# EAGLE design Z80_Sound_2 (EAGLE 5.11)
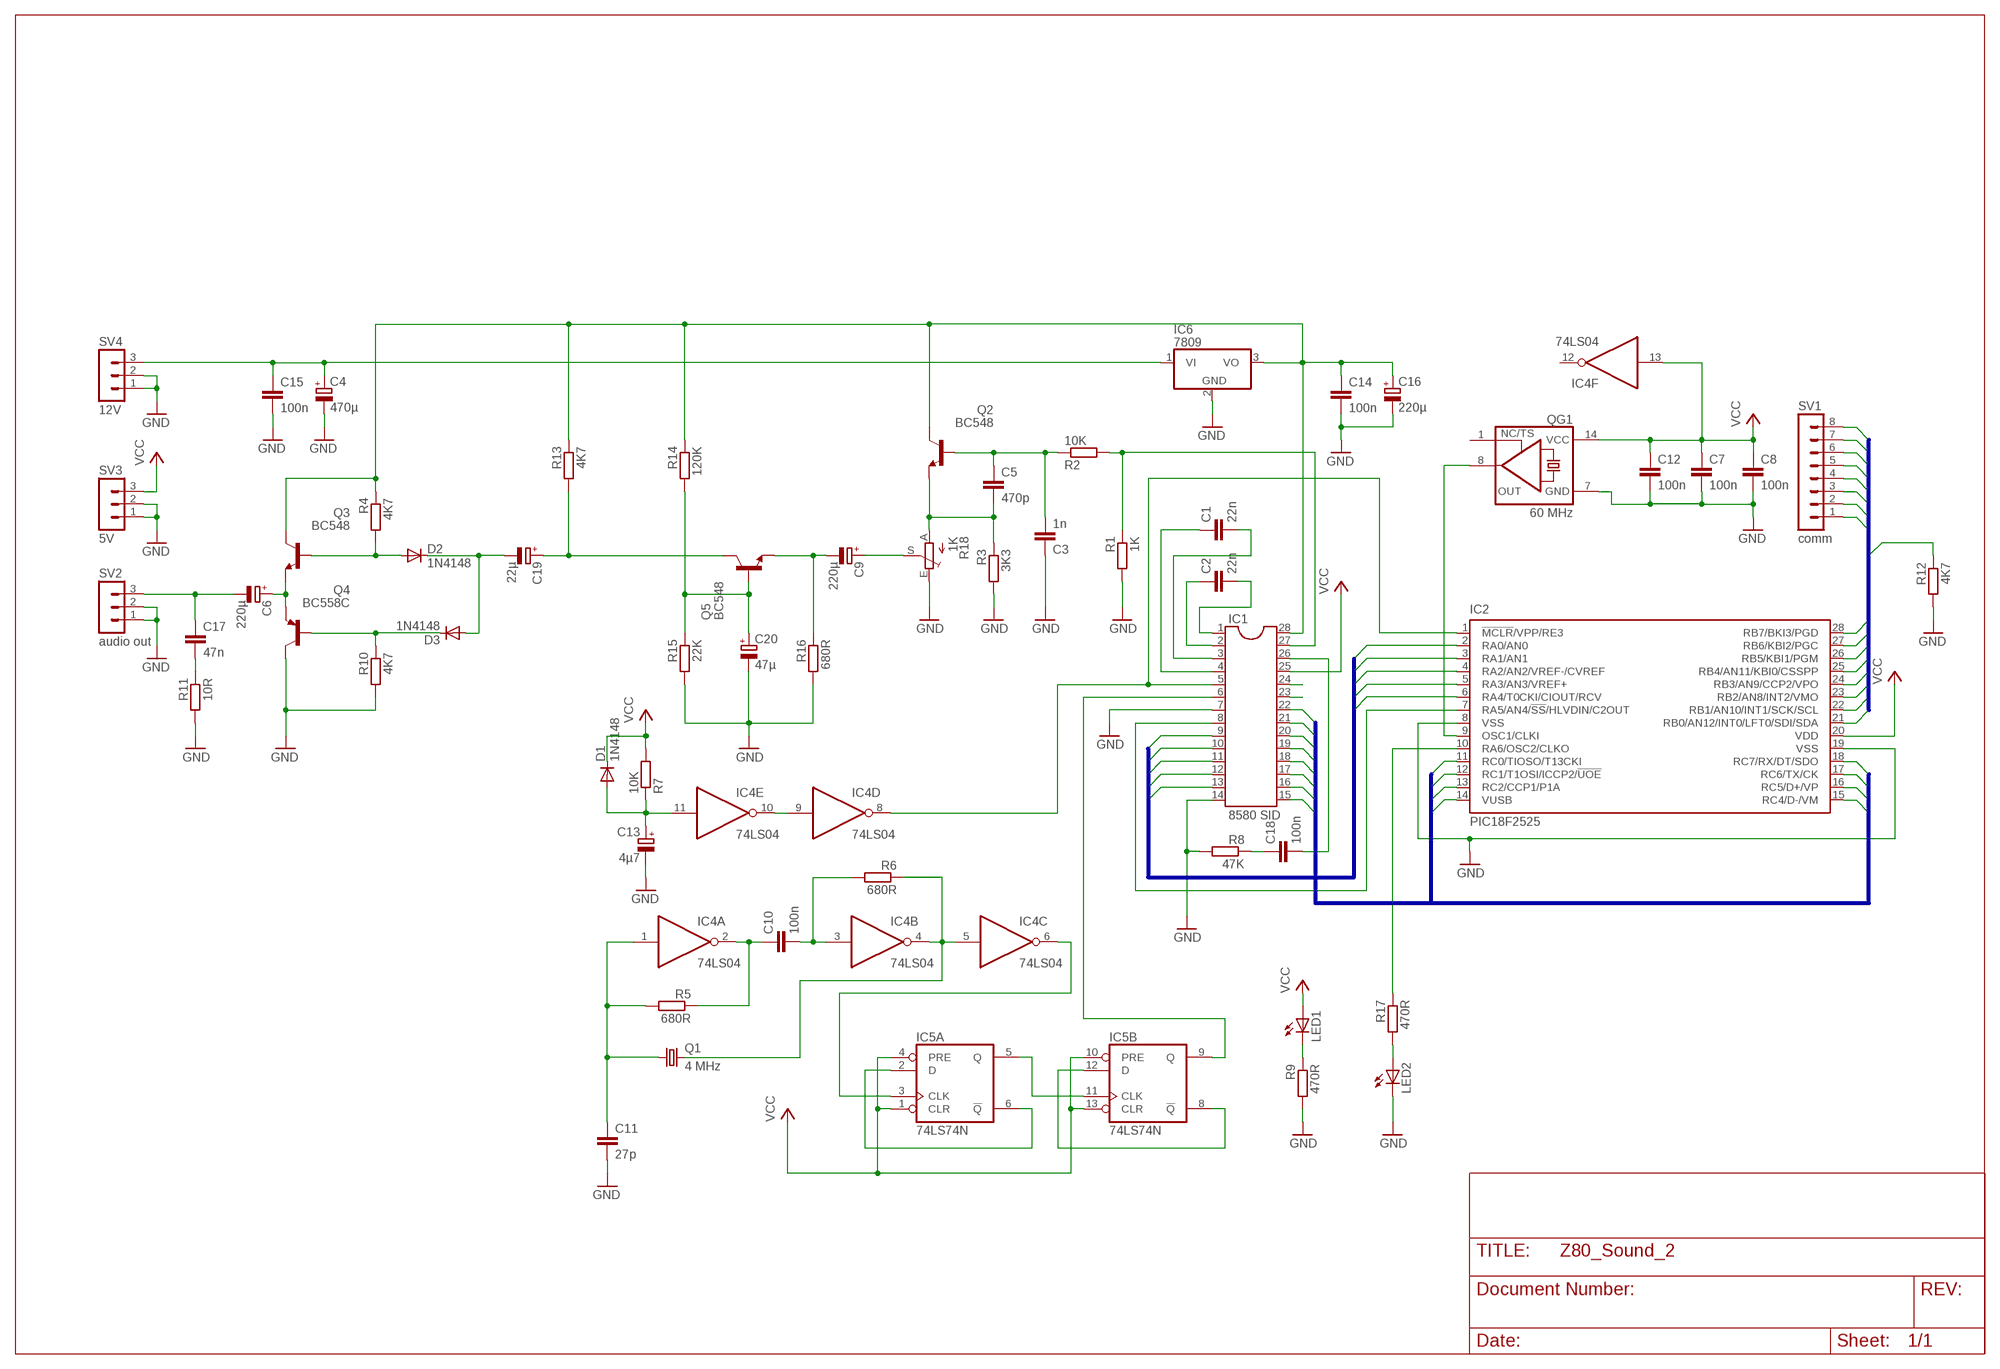
[diagram p0: schematic, sheet 1]

## Parts
C1  22n  C-EU050-035X075  [C050-035X075]
C2  22n  C-EU050-035X075  [C050-035X075]
C3  1n  C-EU050-035X075  [C050-035X075]
C4  470µ  CPOL-EUE3.5-10  [E3,5-10]
C5  470p  C-EU025-024X044  [C025-024X044]
C6  220µ  CPOL-EUE3.5-8  [E3,5-8]
C7  100n  C-EU050-030X075  [C050-030X075]
C8  100n  C-EU050-030X075  [C050-030X075]
C9  220µ  CPOL-EUE3.5-8  [E3,5-8]
C10  100n  C-EU050-030X075  [C050-030X075]
C11  27p  C-EU025-024X044  [C025-024X044]
C12  100n  C-EU050-030X075  [C050-030X075]
C13  4µ7  CPOL-EUE3.5-8  [E3,5-8]
C14  100n  C-EU050-030X075  [C050-030X075]
C15  100n  C-EU050-030X075  [C050-030X075]
C16  220µ  CPOL-EUE3.5-8  [E3,5-8]
C17  47n  C-EU050-024X044  [C050-024X044]
C18  100n  C-EU050-030X075  [C050-030X075]
C19  22µ  CPOL-EUE3.5-8  [E3,5-8]
C20  47µ  CPOL-EUE3.5-8  [E3,5-8]
D1  1N4148  1N4148DO35-7  [DO35-7]
D2  1N4148  1N4148DO35-7  [DO35-7]
D3  1N4148  1N4148DO35-7  [DO35-7]
IC1  8580 SID  DIL28  [DIL28-6]
IC2  PIC18F2525  PIC18F2455_28DIP  [DIL28-3]
IC4  74LS04  74LS04N  [DIL14]
IC5  74LS74N  [DIL14]
IC6  7809  786TV  [TO220V]
LED1  LED5MM  [LED5MM]
LED2  LED5MM  [LED5MM]
Q1  4 MHz  CRYSTALHC49S  [HC49/S]
Q2  BC548  [TO92-EBC]
Q3  BC548  [TO92-EBC]
Q4  BC558C  [TO92-EBC]
Q5  BC548  [TO92-EBC]
QG1  60 MHz  XO-14  [DIL14S]
R1  1K  R-EU_0207/10  [0207/10]
R2  10K  R-EU_0207/10  [0207/10]
R3  3K3  R-EU_0207/2V  [0207/2V]
R4  4K7  R-EU_0207/10  [0207/10]
R5  680R  R-EU_0207/10  [0207/10]
R6  680R  R-EU_0207/10  [0207/10]
R7  10K  R-EU_0207/10  [0207/10]
R8  47K  R-EU_0207/10  [0207/10]
R9  470R  R-EU_0207/10  [0207/10]
R10  4K7  R-EU_0207/10  [0207/10]
R11  10R  R-EU_0207/10  [0207/10]
R12  4K7  R-EU_0207/10  [0207/10]
R13  4K7  R-EU_0207/10  [0207/10]
R14  120K  R-EU_0207/10  [0207/10]
R15  22K  R-EU_0207/10  [0207/10]
R16  680R  R-EU_0207/2V  [0207/2V]
R17  470R  R-EU_0207/10  [0207/10]
R18  1K  TRIM_EU-LI15  [LI15]
SV1  comm  MA08-1  [MA08-1]
SV2  audio out  MA03-1  [MA03-1]
SV3  5V  MA03-1  [MA03-1]
SV4  12V  MA03-1  [MA03-1]

## Nets
+12V: C4.+ C15.1 IC6.1(VI) SV4.3
/CS: IC1.8 IC2.7(RA5/AN4/!SS!/HLVDIN/C2OUT)
/RES: IC1.5 IC2.1(!MCLR!/VPP/RE3) IC4.8(D:O)
A0: IC1.9 IC2.2(RA0/AN0)
A1: IC1.10 IC2.3(RA1/AN1)
A2: IC1.11 IC2.4(RA2/AN2/VREF-/CVREF)
A3: IC1.12 IC2.5(RA3/AN3/VREF+)
A4: IC1.13 IC2.6(RA4/T0CKI/CIOUT/RCV)
AUDIO_OUT: IC1.27 R1.1 R2.2
CAP1A: C2.2 IC1.1
CAP1B: C2.1 IC1.2
CAP2A: C1.2 IC1.3
CAP2B: C1.1 IC1.4
CLK_1MHZ: IC1.6 IC5.9(B:Q)
CLK_2MHZ: IC5.5(A:Q) IC5.11(B:CLK)
CLK_4MHZ: IC4.6(C:O) IC5.3(A:CLK)
CLKI: IC2.9(OSC1/CLKI) QG1.8(OUT)
D0: IC1.15 IC2.11(RC0/TIOSO/T13CKI)
D1: IC1.16 IC2.12(RC1/T1OSI/ICCP2/!UOE)
D2: IC1.17 IC2.13(RC2/CCP1/P1A)
D3: IC1.18 IC2.14(VUSB)
D4: IC1.19 IC2.15(RC4/D-/VM)
D5: IC1.20 IC2.16(RC5/D+/VP)
D6: IC1.21 IC2.17(RC6/TX/CK)
D7: IC1.22 IC2.18(RC7/RX/DT/SDO)
GND: C3.1 C4.- C7.2 C8.2 C11.2 C12.2 C13.- C14.2 C15.2 C16.- C20.- IC1.7 IC1.14 IC2.8(VSS) IC2.19(VSS) IC6.2(GND) LED2.K(C) Q4.C QG1.7(GND) R1.2 R3.2 R8.2 R9.2 R10.2 R11.2 R12.2 R15.2 R16.2 R18.E SV2.1 SV2.2 SV3.1 SV3.2 SV4.1 SV4.2
N$2: IC4.4(B:O) IC4.5(C:I) Q1.2 R6.1
N$3: C5.2 Q2.E R3.1 R18.A
N$4: LED1.K(C) R9.1
N$5: C6.- C17.1 SV2.3
N$6: C3.2 C5.1 Q2.B R2.1
N$7: LED2.A R17.2
N$8: C17.2 R11.1
N$9: D3.C Q4.B R10.1
N$10: D2.A Q3.B R4.2
N$11: C11.1 IC4.1(A:I) Q1.1 R5.2
N$12: IC5.2(A:D) IC5.6(A:!Q)
N$13: IC5.8(B:!Q) IC5.12(B:D)
N$16: IC4.9(D:I) IC4.10(E:O)
N$17: C13.+ D1.A IC4.11(E:I) R7.1
N$18: C10.1 IC4.2(A:O) R5.1
N$19: C10.2 IC4.3(B:I) R6.2
N$20: C18.2 IC1.26
N$21: C6.+ Q3.E Q4.E
N$22: C19.- D2.C D3.A
N$23: C18.1 R8.1
N$25: C19.+ Q5.C R13.2
N$26: C9.- Q5.E R16.1
N$27: C20.+ Q5.B R14.2 R15.1
N$30: C9.+ R18.S
POTX: IC1.24
POTY: IC1.23
RA6: IC2.10(RA6/OSC2/CLKO) R17.1
RB0: IC2.21(RB0/AN12/INT0/LFT0/SDI/SDA) SV1.1
RB1: IC2.22(RB1/AN10/INT1/SCK/SCL) SV1.2
RB2: IC2.23(RB2/AN8/INT2/VMO) SV1.3
RB3: IC2.24(RB3/AN9/CCP2/VPO) SV1.4
RB4: IC2.25(RB4/AN11/KBI0/CSSPP) SV1.5
RB5: IC2.26(RB5/KBI1/PGM) SV1.6
RB6: IC2.27(RB6/KBI2/PGC) SV1.7
RB7: IC2.28(RB7/BKI3/PGD) R12.1 SV1.8
VCC: C7.1 C8.1 C12.1 D1.C IC1.25 IC2.20(VDD) IC4.13(F:I) IC5.1(A:CLR) IC5.4(A:PRE) IC5.10(B:PRE) IC5.13(B:CLR) LED1.A QG1.14(VCC) R7.2 SV3.3
VDD: C14.1 C16.+ IC1.28 IC6.3(VO) Q2.C Q3.C R4.1 R13.1 R14.1
Unconnected: IC4.12(F:O) QG1.1(TS)

## Buses
D[0..7]
RB[0..7]
A[0..4]

## Power pins joined to a net without a drawn wire
GND: IC4.7(P:GND) IC5.7(P:GND)
VCC: IC4.14(P:VCC) IC5.14(P:VCC)

## Library data of the parts
C1-C3 C5 C7 C8 C10-C12 C14 C15 C17 C18 = rcl:C-EU: CAPACITOR, European symbol
C4 C6 C9 C13 C16 C19 C20 = rcl:CPOL-EU: POLARIZED CAPACITOR, European symbol
D1-D3 = diode:1N4148: DIODE high speed (Philips)
IC1 = ic-package:DIL28: Dual In Line
IC2 = microchip:PIC18F2*_28: USB Microcontrollers with nanoWatt Technology High-Performance, Enhanced Flash, 28/40/44-Pin, Source: http://ww1.microchip.com/downloads/en/devicedoc/39632c.pdf
IC4 = 74xx-us:74*04: Hex INVERTER
IC5 = 74xx-us:74*74: Dual D type positive edge triggered FLIP FLOP, preset and clear
IC6 = linear:78*: Positive VOLTAGE REGULATOR Source: http://cache.national.com/ds/LM/LM78L05.pdf http://www.fairchildsemi.com/ds/LM/LM7805.pdf
LED1 LED2 = led:LED: LED OSRAM: - CHIPLED LG R971, LG N971, LY N971, LG Q971, LY Q971, LO R971, LY R971 LH N974, LH R974 LS Q976, LO Q976, LY Q976 LO Q996 - Hyper CHIPLED LW Q18S LB Q993, LB Q99A, LB R99A - SideLED LS A670, LO A670, LY A670, LG A670, LP A670 LB A673, LV A673, LT A673, LW A673 LH A674 LY A675 LS A676, LA A676, LO A676, LY A676, LW A676 LS A679, LY A679, LG A679 - Hyper Micro SIDELED® LS Y876, LA Y876, LO Y876, LY Y876 LT Y87S - SmartLED LW L88C, LW L88S LB L89C, LB L89S, LG L890 LS L89K, LO L89K, LY L89K LS L896, LA L896, LO L896, LY L896 - TOPLED LS T670, LO T670, LY T670, LG T670, LP T670 LSG T670, LSP T670, LSY T670, LOP T670, LYG T670 LG T671, LOG T671, LSG T671 LB T673, LV T673, LT T673, LW T673 LH T674 LS T676, LA T676, LO T676, LY T676, LB T676, LH T676, LSB T676, LW T676 LB T67C, LV T67C, LT T67C, LS T67K, LO T67K, LY T67K, LW E67C LS E67B, LA E67B, LO E67B, LY E67B, LB E67C, LV E67C, LT E67C LW T67C LS T679, LY T679, LG T679 LS T770, LO T770, LY T770, LG T770, LP T770 LB T773, LV T773, LT T773, LW T773 LH T774 LS E675, LA E675, LY E675, LS T675 LS T776, LA T776, LO T776, LY T776, LB T776 LHGB T686 LT T68C, LB T68C - Hyper Mini TOPLED® LB M676 - Mini TOPLED Santana® LG M470 LS M47K, LO M47K, LY M47K Source: http://www.osram.convergy.de LUXEON: - LUMILED® LXK2-PW12-R00, LXK2-PW12-S00, LXK2-PW14-U00, LXK2-PW14-V00 LXK2-PM12-R00, LXK2-PM12-S00, LXK2-PM14-U00 LXK2-PE12-Q00, LXK2-PE12-R00, LXK2-PE12-S00, LXK2-PE14-T00, LXK2-PE14-U00 LXK2-PB12-K00, LXK2-PB12-L00, LXK2-PB12-M00, LXK2-PB14-N00, LXK2-PB14-P00, LXK2-PB14-Q00 LXK2-PR12-L00, LXK2-PR12-M00, LXK2-PR14-Q00, LXK2-PR14-R00 LXK2-PD12-Q00, LXK2-PD12-R00, LXK2-PD12-S00 LXK2-PH12-R00, LXK2-PH12-S00 LXK2-PL12-P00, LXK2-PL12-Q00, LXK2-PL12-R00 Source: www.luxeon.com KINGBRIGHT: KA-3528ASYC Source: www.kingbright.com
Q1 = crystal:CRYSTAL: CRYSTAL
Q2 Q3 Q5 = transistor-npn:BC548*: NPN Transistor
Q4 = transistor-pnp:BC558*: PNP Transistror
QG1 = crystal:XO-: CRYSTAL
R1-R17 = rcl:R-EU_: RESISTOR, European symbol
R18 = pot:TRIM_EU-: POTENTIOMETER
SV1 = con-lstb:MA08-1: PIN HEADER
SV2-SV4 = con-lstb:MA03-1: PIN HEADER

## Board
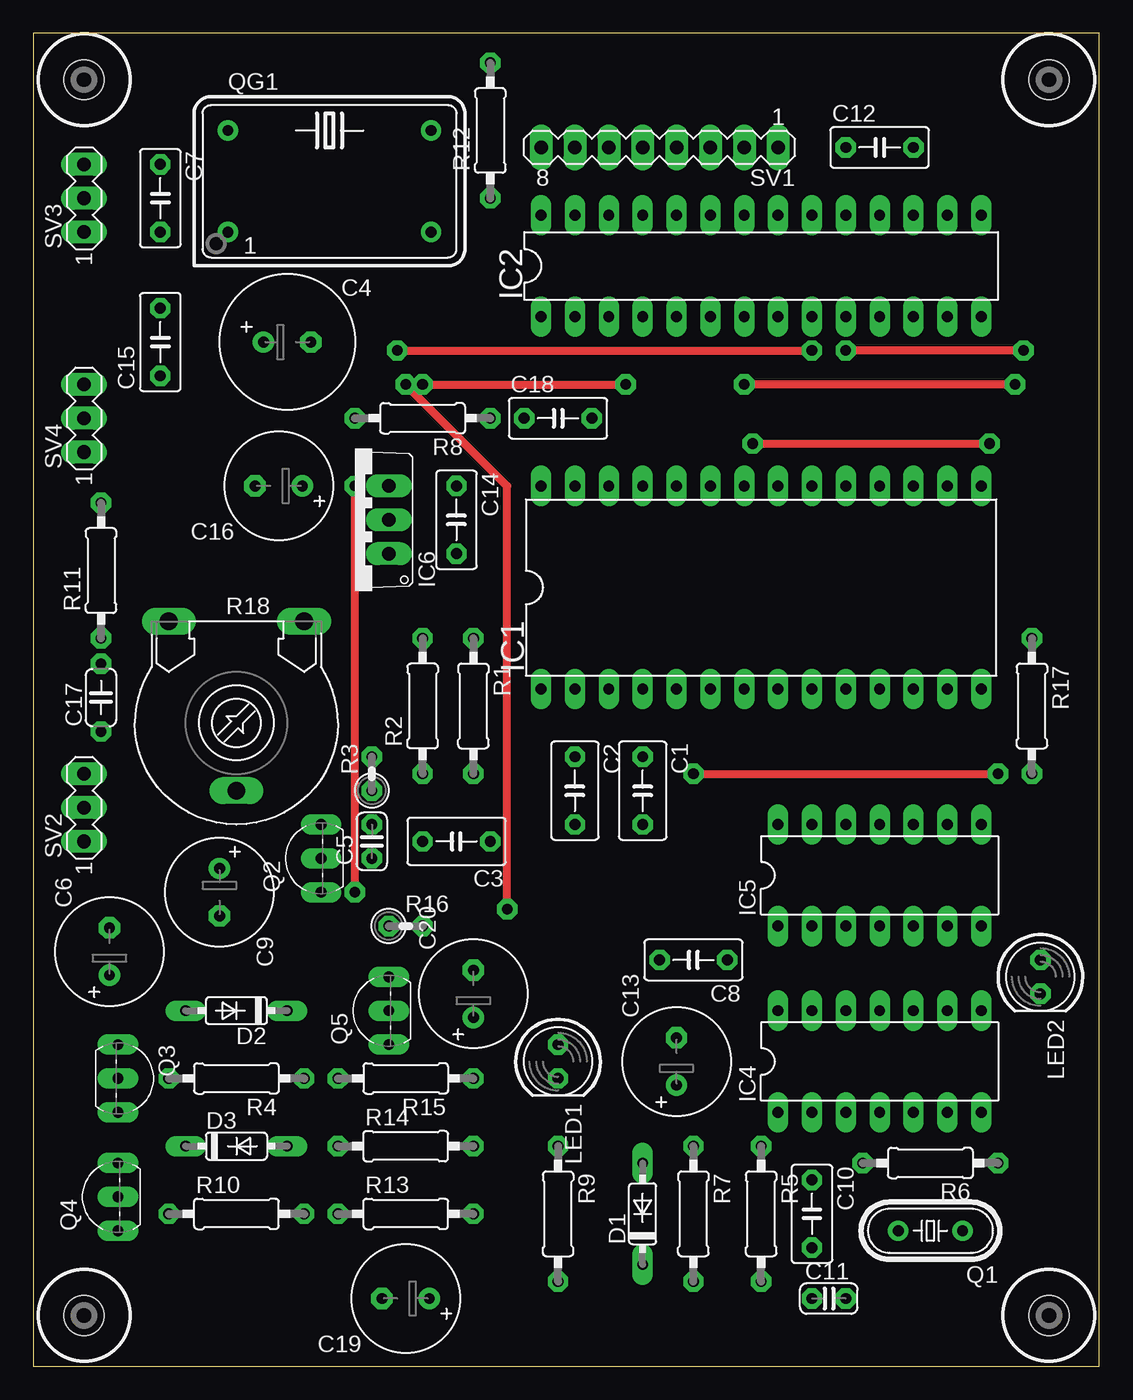
[diagram p1: board, top side]
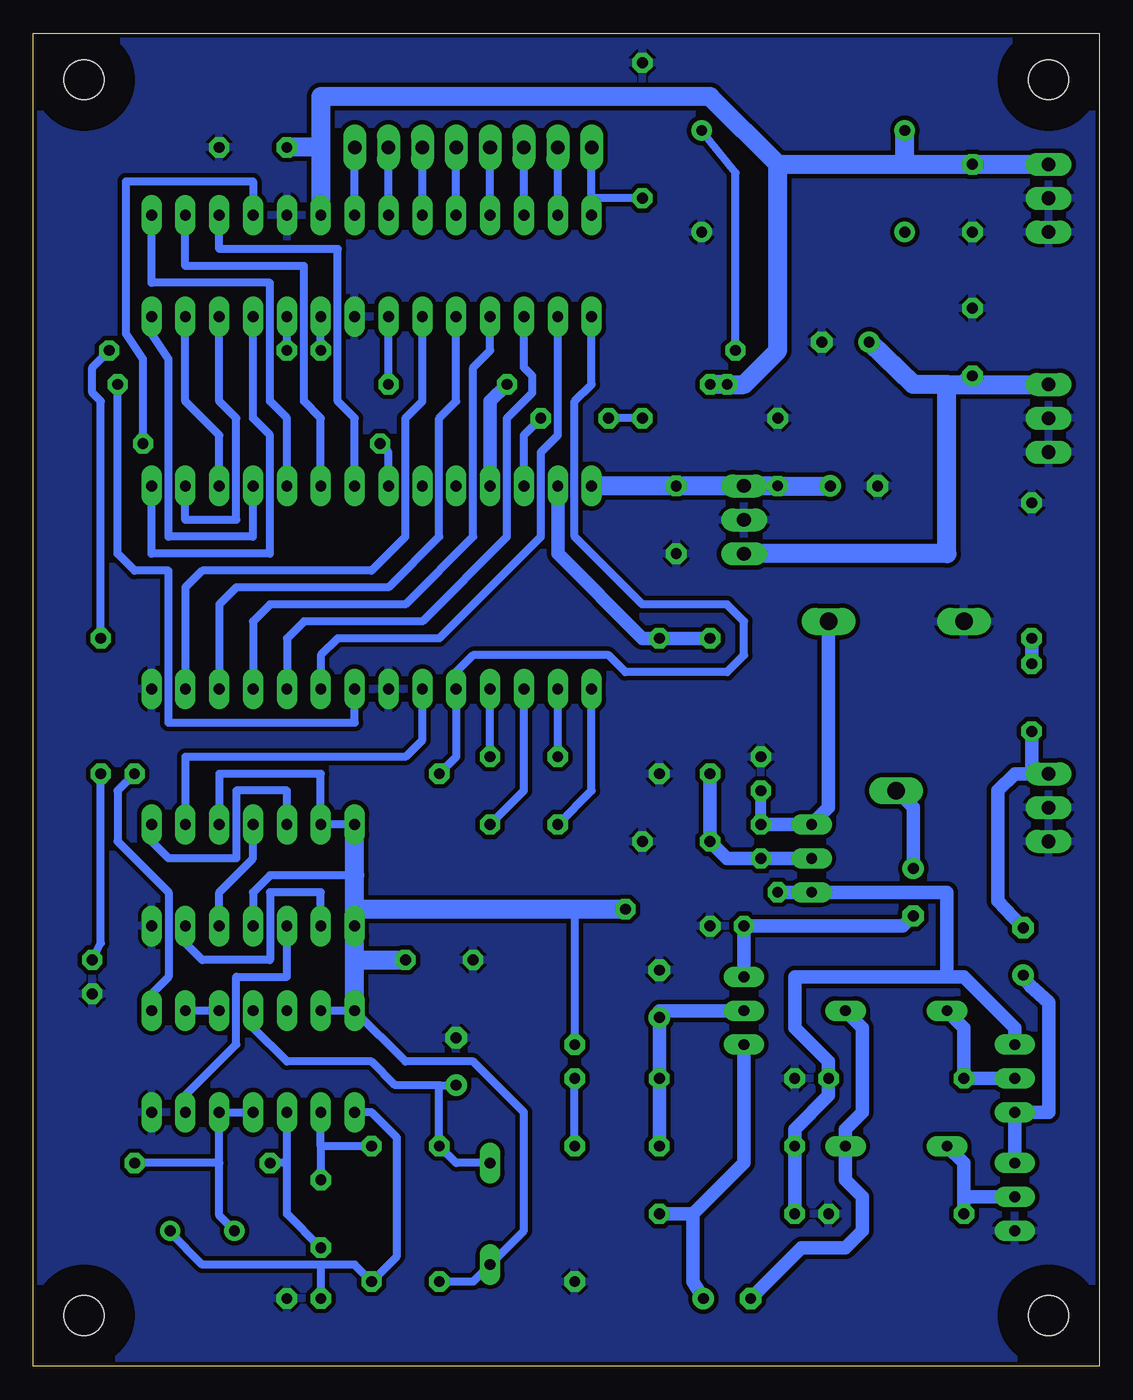
[diagram p2: board, bottom side, seen from below]

Size 79.99 x 100 mm. Coordinates in mm from the lower left corner, seen from the top.
Outline: 0,0 79.99,0 79.99,100 0,100 0,0
Copper layers (1*16): Top 0.035mm / dielectric 1.5mm / Bottom 0.035mm
Design rules "default *": minimum track width 10mil, minimum drill 24mil, track to track 13mil, track to pad 13mil, pad to pad 8mil, via to via 8mil, smd to smd 8mil, copper to edge 12mil, drill to drill 8mil, minimum pad ring 14mil, minimum via ring 14mil, stop-mask expansion 4mil, vias tented up to drill 0mil, thermal gap 10mil

### Footprints (pad centres in the part's own frame; a part is rotated, then mirrored left to right if it is on the bottom)
C050-035X075 = drill 0.813 octagon: 1 -2.54,0; 2 2.54,0
E3,5-10 = drill 0.813 pad 1.6 round: + -1.778,0 | drill 0.813 pad 1.6 octagon: - 1.778,0
C025-024X044 = drill 0.813 octagon: 1 -1.27,0; 2 1.27,0
E3,5-8 = drill 0.813 pad 1.6 round: + -1.778,0 | drill 0.813 pad 1.6 octagon: - 1.778,0
C050-030X075 = drill 0.813 octagon: 1 -2.54,0; 2 2.54,0
C050-024X044 = drill 0.813 octagon: 1 -2.54,0; 2 2.54,0
DO35-7 = drill 0.813 long: A 3.81,0; C -3.81,0
DIL28-6 = drill 0.813 long: 1 -16.51,-7.62; 2 -13.97,-7.62; 3 -11.43,-7.62; 4 -8.89,-7.62; 5 -6.35,-7.62; 6 -3.81,-7.62; 7 -1.27,-7.62; 8 1.27,-7.62; 9 3.81,-7.62; 10 6.35,-7.62; 11 8.89,-7.62; 12 11.43,-7.62; 13 13.97,-7.62; 14 16.51,-7.62; 15 16.51,7.62; 16 13.97,7.62; 17 11.43,7.62; 18 8.89,7.62; 19 6.35,7.62; 20 3.81,7.62; 21 1.27,7.62; 22 -1.27,7.62; 23 -3.81,7.62; 24 -6.35,7.62; 25 -8.89,7.62; 26 -11.43,7.62; 27 -13.97,7.62; 28 -16.51,7.62
DIL28-3 = drill 0.813 long: 1 -16.51,-3.81; 2 -13.97,-3.81; 3 -11.43,-3.81; 4 -8.89,-3.81; 5 -6.35,-3.81; 6 -3.81,-3.81; 7 -1.27,-3.81; 8 1.27,-3.81; 9 3.81,-3.81; 10 6.35,-3.81; 11 8.89,-3.81; 12 11.43,-3.81; 13 13.97,-3.81; 14 16.51,-3.81; 15 16.51,3.81; 16 13.97,3.81; 17 11.43,3.81; 18 8.89,3.81; 19 6.35,3.81; 20 3.81,3.81; 21 1.27,3.81; 22 -1.27,3.81; 23 -3.81,3.81; 24 -6.35,3.81; 25 -8.89,3.81; 26 -11.43,3.81; 27 -13.97,3.81; 28 -16.51,3.81
DIL14 = drill 0.813 long: 1 -7.62,-3.81; 2 -5.08,-3.81; 3 -2.54,-3.81; 4 0,-3.81; 5 2.54,-3.81; 6 5.08,-3.81; 7 7.62,-3.81; 8 7.62,3.81; 9 5.08,3.81; 10 2.54,3.81; 11 0,3.81; 12 -2.54,3.81; 13 -5.08,3.81; 14 -7.62,3.81
TO220V = drill 1.016 long: 1 -2.54,-2.54; 2 0,-2.54; 3 2.54,-2.54
LED5MM = drill 0.813 octagon: A -1.27,0; K 1.27,0
HC49/S = drill 0.813 round: 1 -2.413,0; 2 2.413,0
TO92-EBC = drill 0.813 long: B 0,-1.27; C -2.54,-1.27; E 2.54,-1.27
DIL14S = drill 0.813 round: 1 -7.62,-3.81; 7 7.62,-3.81; 8 7.62,3.81; 14 -7.62,3.81
0207/10 = drill 0.813 octagon: 1 -5.08,0; 2 5.08,0
0207/2V = drill 0.813 octagon: 1 -1.27,0; 2 1.27,0
LI15 = drill 1.321 long: A -5.08,-7.62; E 5.08,-7.62; S 0,5.08
MA08-1 = drill 1.016 long: 1 -8.89,0; 2 -6.35,0; 3 -3.81,0; 4 -1.27,0; 5 1.27,0; 6 3.81,0; 7 6.35,0; 8 8.89,0
MA03-1 = drill 1.016 long: 1 -2.54,0; 2 0,0; 3 2.54,0
DRIL-3 = hole 3: 0,0

### Placement (x,y rotation side)
C1  45.72,43.18 270 top
C2  40.64,43.18 270 top
C3  31.75,39.37 180 top
C4  19.05,76.83 0 top
C5  25.4,39.37 90 top
C6  5.71,31.11 90 top
C7  9.53,87.63 270 top
C8  49.53,30.48 180 top
C9  13.97,35.56 270 top
C10  58.42,11.43 270 top
C11  59.69,5.08 0 top
C12  63.5,91.44 0 top
C13  48.26,22.86 90 top
C14  31.75,63.5 270 top
C15  9.53,76.83 90 top
C16  18.41,66.04 180 top
C17  5.08,50.16 90 top
C18  39.37,71.12 0 top
C19  27.94,5.08 180 top
C20  33.02,27.94 90 top
D1  45.72,11.43 90 top
D2  15.24,26.67 180 top
D3  15.24,16.51 0 top
IC1  54.61,58.42 0 top
IC2  54.61,82.55 0 top
IC4  63.5,22.86 0 top
IC5  63.5,36.83 0 top
IC6  24.13,63.5 90 top
LED1  39.37,22.86 270 top
LED2  75.56,29.21 270 top
Q1  67.31,10.16 180 top
Q2  20.32,38.1 90 top
Q3  7.62,21.59 270 top
Q4  5.08,12.7 90 top
Q5  25.4,26.67 90 top
QG1  22.23,88.9 0 top
R1  33.02,49.53 270 top
R2  29.21,49.53 90 top
R3  25.4,44.45 90 top
R4  15.24,21.59 180 top
R5  54.61,11.43 270 top
R6  67.31,15.24 180 top
R7  49.53,11.43 270 top
R8  29.21,71.12 180 top
R9  39.37,11.43 270 top
R10  15.24,11.43 0 top
R11  5.08,59.69 90 top
R12  34.29,92.71 90 top
R13  27.94,11.43 0 top
R14  27.94,16.51 0 top
R15  27.94,21.59 180 top
R16  27.94,33.02 0 top
R17  74.93,49.53 270 top
R18  15.24,48.26 180 top
SV1  46.99,91.44 180 top
SV2  3.81,41.91 90 top
SV3  3.81,87.63 90 top
SV4  3.81,71.12 90 top
U$1  [DRIL-3]  76.2,96.52 0 top
U$2  [DRIL-3]  76.2,3.81 0 top
U$3  [DRIL-3]  3.81,3.81 0 top
U$4  [DRIL-3]  3.81,96.52 0 top

### Tracks (layer width: path | path; a pad name or v marks a point on that pad's centre or on a via)
+12V
  Bottom 1.422: IC6.1 11.43,60.96 11.43,73.66 | 11.43,73.66 10.16,73.66 | 10.16,73.66 SV4.3 | 10.16,73.66 C15.1 | 11.43,73.66 13.97,73.66 C4.+
/CS  (via drill 0.8)
  Top 0.61: v73.66,73.66 v53.34,73.66
  Bottom 0.61: v53.34,73.66 IC2.7 | IC1.8 55.88,48.26 69.85,48.26 69.85,59.69 72.39,59.69 73.66,60.96 v73.66,73.66
/RES  (via drill 0.8)
  Top 0.61: v49.53,44.45 v72.39,44.45
  Bottom 0.61: IC2.1 38.1,73.66 39.37,72.39 39.37,62.23 34.29,57.15 27.94,57.15 26.67,55.88 26.67,53.34 27.94,52.07 35.56,52.07 36.83,53.34 46.99,53.34 48.26,52.07 IC1.5 48.26,45.72 v49.53,44.45 | IC4.8 71.12,27.94 69.85,29.21 69.85,35.56 73.66,39.37 73.66,43.18 v72.39,44.45
A0
  Bottom 0.61: IC1.9 58.42,53.34 57.15,54.61 49.53,54.61 41.91,62.23 41.91,68.58 40.64,69.85 IC2.2
A1
  Bottom 0.61: IC1.10 60.96,54.61 59.69,55.88 50.8,55.88 44.45,62.23 44.45,71.12 42.55,73.03 42.55,74.3 43.18,74.93 IC2.3
A2
  Bottom 0.61: IC1.11 63.5,55.88 62.23,57.15 52.07,57.15 46.99,62.23 46.99,74.93 45.72,76.2 IC2.4
A3
  Bottom 0.61: IC1.12 66.04,57.15 64.77,58.42 53.34,58.42 49.53,62.23 49.53,71.12 48.26,72.39 IC2.5
A4
  Bottom 0.61: IC2.6 50.8,72.39 52.07,71.12 52.07,62.23 54.61,59.69 67.31,59.69 68.58,58.42 IC1.13
AUDIO_OUT
  Bottom 1.016: R2.2 R1.1 34.29,54.61 40.64,60.96 IC1.27
CAP1A
  Bottom 0.61: IC1.1 38.1,43.18 C2.2
CAP1B
  Bottom 0.61: C2.1 IC1.2
CAP2A
  Bottom 0.61: IC1.3 43.18,43.18 C1.2
CAP2B
  Bottom 0.61: C1.1 IC1.4
CLK_1MHZ
  Bottom 0.61: IC5.9 68.58,45.72 52.07,45.72 50.8,46.99 IC1.6
CLK_2MHZ
  Bottom 0.61: IC5.5 66.04,35.56 63.5,38.1 IC5.11
CLK_4MHZ
  Bottom 0.61: IC4.6 68.58,20.32 64.77,24.13 64.77,29.21 60.96,29.21 IC5.3
CLKI  (via drill 0.8)
  Top 0.61: v27.3,76.2 v58.42,76.2
  Bottom 0.61: v58.42,76.2 IC2.9 | v27.3,76.2 27.3,89.53 QG1.8
D0
  Bottom 0.61: IC2.11 63.5,71.12 62.23,69.85 62.23,60.96 71.12,60.96 IC1.15
D1
  Bottom 0.61: IC1.16 68.58,63.5 64.77,63.5 64.77,71.12 66.04,72.39 IC2.12
D2
  Bottom 0.61: IC2.13 68.58,72.39 66.04,69.85 IC1.17
D3
  Bottom 0.61: IC1.18 63.5,62.23 69.85,62.23 69.85,75.56 71.12,77.47 IC2.14
D4
  Bottom 0.61: IC1.19 60.96,71.12 62.23,72.39 62.23,81.28 71.12,81.28 IC2.15
D5
  Bottom 0.61: IC2.16 68.58,82.55 59.69,82.55 59.69,72.39 58.42,71.12 IC1.20
D6
  Bottom 0.61: IC2.17 66.04,83.82 57.15,83.82 57.15,72.39 55.88,71.12 IC1.21
D7  (via drill 0.8)
  Top 0.61: v53.98,69.22 v71.75,69.22
  Bottom 0.61: IC2.18 63.5,88.9 73.03,88.9 73.03,77.47 71.75,75.56 v71.75,69.22 | IC1.22 53.34,68.58 v53.98,69.22
GND
  pour Bottom: 0,100.33 0,0 80.01,0 80.01,100.33
N$2
  Bottom 0.61: IC4.4 IC4.5 66.04,15.24 | Q1.2 66.04,11.3 66.04,15.24 | 66.04,15.24 R6.1
N$3
  Bottom 0.813: C5.2 R3.1
  Bottom 1.016: C5.2 Q2.E 20.32,41.91 R18.A
N$4
  Bottom 0.61: R9.1 LED1.K
N$5
  Bottom 1.016: 5.08,44.45 6.35,44.45 7.62,43.18 7.62,34.92 6.48,33.66 C6.- | 5.08,44.45 SV2.3 | 5.08,44.45 C17.1
N$6
  Bottom 1.016: Q2.B C5.1 27.94,38.1 C3.2 R2.1
N$7
  Bottom 0.61: R17.2 74.93,31.75 LED2.A
N$8
  Bottom 1.016: C17.2 R11.1
N$9
  Bottom 1.016: Q4.B 10.16,12.7 | 10.16,12.7 R10.1 | 10.16,12.7 10.16,15.24 D3.C
N$10
  Bottom 1.016: D2.A 10.16,25.4 R4.2 Q3.B
N$11
  Bottom 0.61: Q1.1 69.72,10.03 67.31,7.62 58.42,7.62 | 58.42,7.62 55.88,7.62 R5.2 52.7,8.26 52.7,17.14 54.61,19.05 IC4.1 | 58.42,7.62 C11.1
N$12
  Bottom 0.61: IC5.2 58.42,35.56 62.23,35.56 62.23,30.48 67.31,30.48 68.58,31.75 IC5.6
N$13
  Bottom 0.61: IC5.8 71.12,39.37 69.85,38.1 64.77,38.1 64.77,43.18 60.96,43.18 IC5.12
N$16
  Bottom 0.61: IC4.10 IC4.9
N$17
  Bottom 0.61: 49.53,21.08 C13.+ | 49.53,21.08 52.83,21.08 54.61,22.86 60.96,22.86 63.5,25.4 IC4.11 | D1.A 48.26,15.24 R7.1 49.53,21.08
N$18
  Bottom 0.61: 58.42,16.51 IC4.2 | R5.1 58.42,16.51 | 58.42,16.51 C10.1
N$19
  Bottom 0.61: C10.2 60.96,11.43 60.96,15.24 | 60.96,15.24 IC4.3 | 60.96,15.24 R6.2
N$20
  Bottom 0.61: IC1.26 43.18,69.85 C18.2
N$21
  Bottom 1.016: Q4.E Q3.E 3.81,19.05 3.81,27.3 5.21,28.57 C6.+
N$22
  Bottom 1.016: D2.C 17.78,25.4 17.78,19.05 19.05,17.78 D3.A 19.05,13.97 17.78,12.7 17.78,10.16 19.05,8.89 22.35,8.89 C19.-
N$23
  Bottom 0.61: R8.1 C18.1
N$25
  Bottom 1.016: 30.48,11.43 26.67,15.24 Q5.C | 30.48,11.43 R13.2 | C19.+ 30.48,6.35 30.48,11.43
N$26
  Bottom 1.016: Q5.E R16.1 14.73,33.02 C9.-
N$27
  Bottom 1.016: Q5.B 33.02,26.67 C20.+ R15.1 R14.2
N$30
  Bottom 1.016: C9.+ 13.97,41.91 R18.S
RA6  (via drill 0.8)
  Top 0.61: v74.3,76.2 v60.96,76.2
  Bottom 0.61: v60.96,76.2 IC2.10 | v74.3,76.2 75.56,74.93 75.56,73.03 74.93,72.39 R17.1
RB0
  Bottom 0.61: IC2.21 SV1.1
RB1
  Bottom 0.61: IC2.22 SV1.2
RB2
  Bottom 0.61: IC2.23 SV1.3
RB3
  Bottom 0.61: IC2.24 SV1.4
RB4
  Bottom 0.61: IC2.25 SV1.5
RB5
  Bottom 0.61: IC2.26 SV1.6
RB6
  Bottom 0.61: IC2.27 SV1.7
RB7
  Bottom 0.61: 38.1,87.63 IC2.28 | 38.1,87.63 SV1.8 | R12.1 38.1,87.63
VCC  (via drill 0.8)
  Top 0.61: v35.56,34.29 35.56,66.04 v27.94,73.66 | v29.21,73.66 v44.45,73.66
  Bottom 0.61: IC5.10 66.04,44.45 58.42,44.45 IC5.13 IC5.14 | 55.88,36.83 62.23,36.83 63.5,35.56 IC5.4 | R7.2 46.99,6.35 D1.C 43.18,10.16 43.18,19.05 46.99,22.86 52.07,22.86 IC4.14 IC4.13 | 39.37,34.29 LED1.A
  Bottom 1.016: IC1.25 45.72,72.39 v44.45,73.66
  Bottom 1.422: IC4.14 55.88,30.48 | 55.88,30.48 IC5.1 55.88,34.29 | 55.88,34.29 55.88,36.83 IC5.14 | 58.42,91.44 58.42,95.25 29.21,95.25 24.13,90.17 | 58.42,91.44 IC2.20 | 58.42,91.44 C12.1 | 55.88,30.48 C8.1 | 24.13,90.17 24.13,76.2 26.67,73.66 v27.94,73.66 v29.21,73.66 | 55.88,34.29 39.37,34.29 v35.56,34.29 | 24.13,90.17 14.61,90.17 | SV3.3 C7.1 14.61,90.17 | 14.61,90.17 QG1.14
VDD  (via drill 0.8)
  Top 0.61: v24.13,35.56 v24.13,66.04
  Bottom 1.016: R13.1 R14.1 22.86,17.78 20.32,20.32 R4.1 20.32,22.86 22.86,25.4 22.86,29.21 11.43,29.21 | Q3.C 6.35,25.4 10.16,29.21 11.43,29.21 | 11.43,29.21 11.43,35.56 Q2.C v24.13,35.56
  Bottom 1.422: IC1.28 C14.1 IC6.3 v24.13,66.04 C16.+